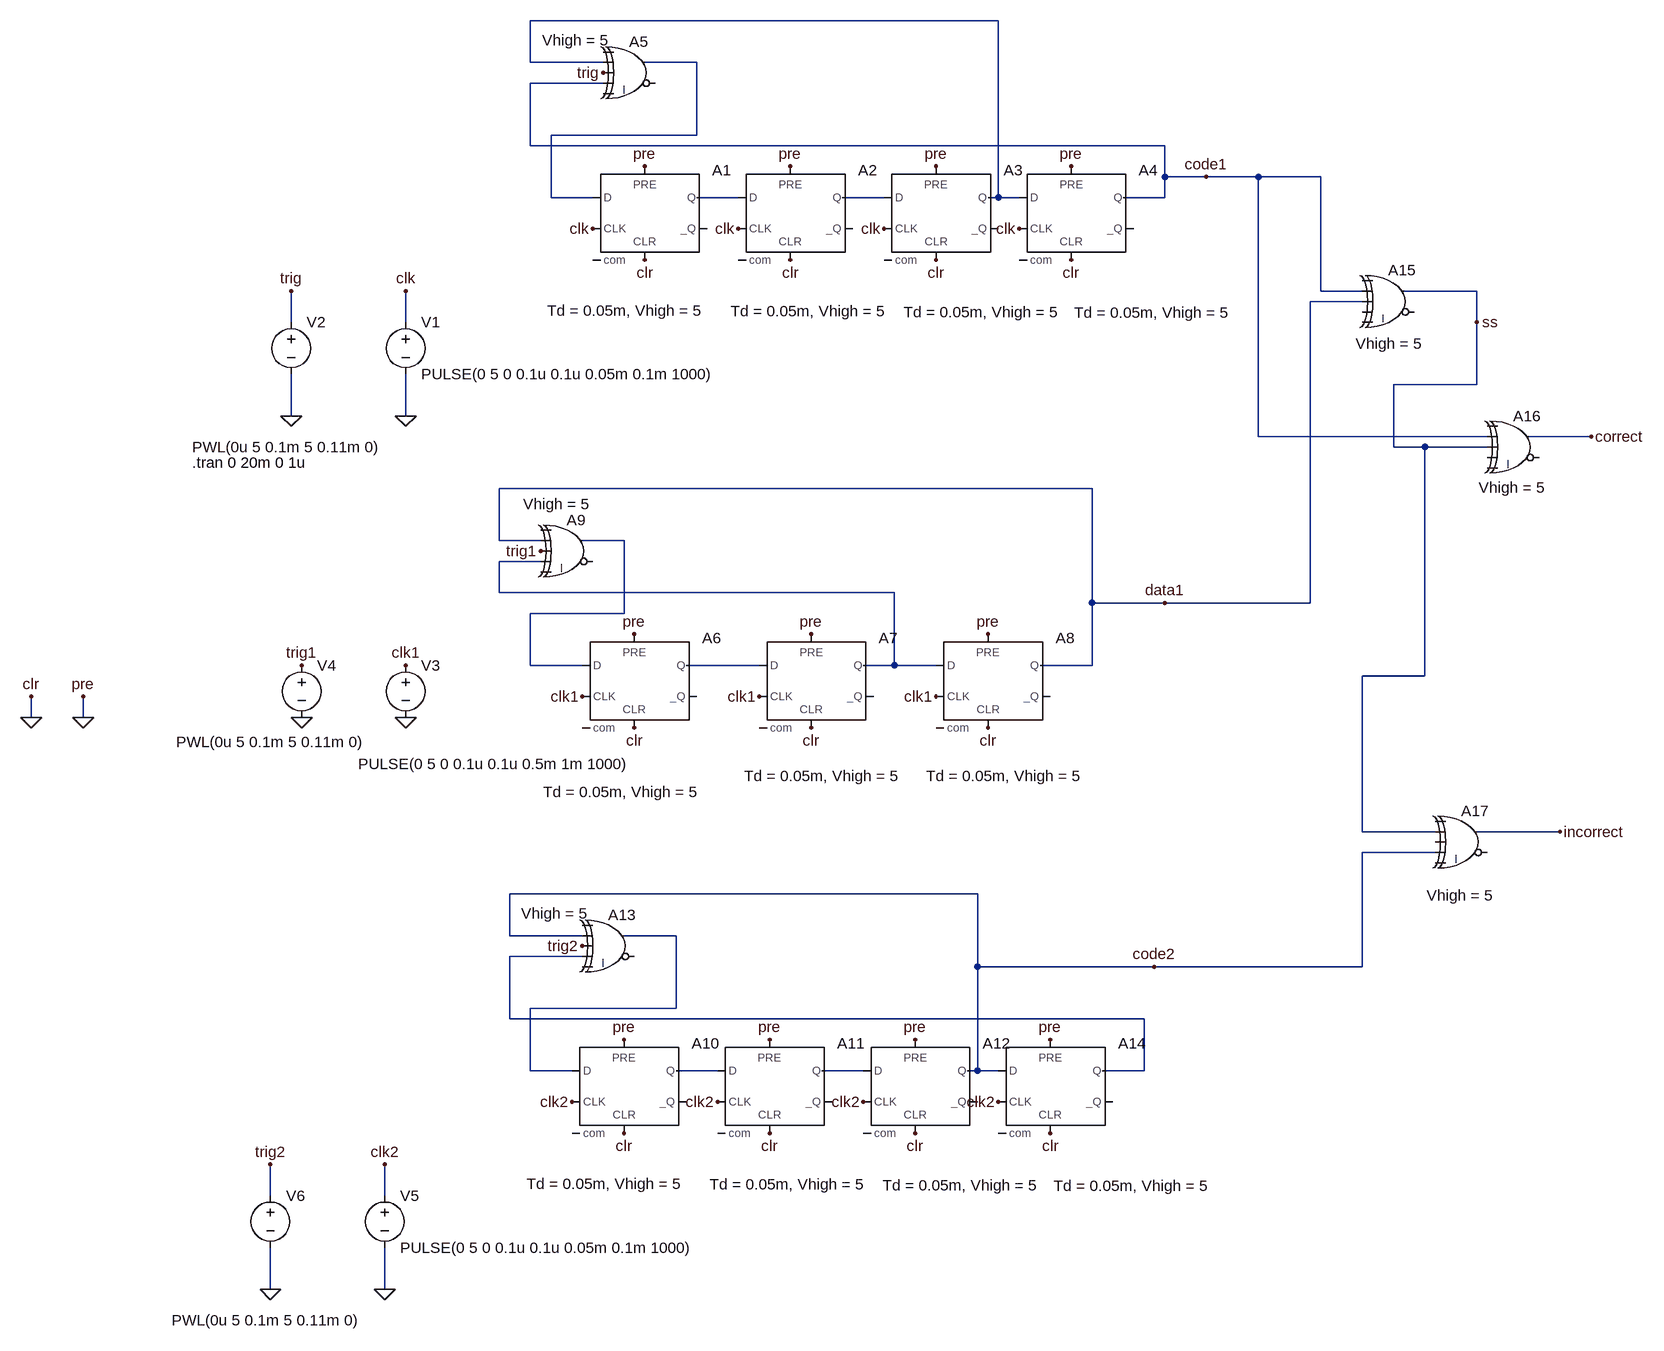
[diagram p0: schematic CDMA.asc]
CDMA.asc, the LTspice schematic file:
Version 4.1
SHEET 1 1652 1904
WIRE 640 -112 -80 -112
WIRE -80 -48 -80 -112
WIRE 32 -48 -80 -48
WIRE 176 -48 96 -48
WIRE 32 -16 -80 -16
WIRE 176 64 176 -48
WIRE 176 64 -48 64
WIRE -80 80 -80 -16
WIRE 896 80 -80 80
WIRE 896 128 896 80
WIRE 960 128 896 128
WIRE 1040 128 960 128
WIRE 1136 128 1040 128
WIRE -48 160 -48 64
WIRE 16 160 -48 160
WIRE 240 160 176 160
WIRE 464 160 400 160
WIRE 640 160 640 -112
WIRE 640 160 624 160
WIRE 672 160 640 160
WIRE 896 160 896 128
WIRE 896 160 832 160
WIRE 1136 304 1136 128
WIRE 1200 304 1136 304
WIRE 1376 304 1264 304
WIRE 1200 320 1120 320
WIRE -448 352 -448 304
WIRE -272 352 -272 304
WIRE 1376 352 1376 304
WIRE 1376 448 1376 352
WIRE 1376 448 1248 448
WIRE -448 496 -448 432
WIRE -272 496 -272 432
WIRE 1040 528 1040 128
WIRE 1392 528 1040 528
WIRE 1552 528 1456 528
WIRE 1248 544 1248 448
WIRE 1296 544 1248 544
WIRE 1392 544 1296 544
WIRE 784 608 -128 608
WIRE -128 688 -128 608
WIRE -64 688 -128 688
WIRE 64 688 0 688
WIRE -64 720 -128 720
WIRE -128 768 -128 720
WIRE 480 768 -128 768
WIRE 784 784 784 608
WIRE 896 784 784 784
WIRE 1120 784 1120 320
WIRE 1120 784 896 784
WIRE 64 800 64 688
WIRE 64 800 -80 800
WIRE -80 880 -80 800
WIRE 0 880 -80 880
WIRE 272 880 160 880
WIRE 480 880 480 768
WIRE 480 880 432 880
WIRE 544 880 480 880
WIRE 784 880 784 784
WIRE 784 880 704 880
WIRE 1296 896 1296 544
WIRE 1296 896 1200 896
WIRE -848 960 -848 928
WIRE -768 960 -768 928
WIRE 1200 1136 1200 896
WIRE 1312 1136 1200 1136
WIRE 1504 1136 1376 1136
WIRE 1312 1168 1200 1168
WIRE 608 1232 -112 1232
WIRE -112 1296 -112 1232
WIRE 0 1296 -112 1296
WIRE 144 1296 64 1296
WIRE 0 1328 -112 1328
WIRE 608 1344 608 1232
WIRE 880 1344 608 1344
WIRE 1200 1344 1200 1168
WIRE 1200 1344 880 1344
WIRE 144 1408 144 1296
WIRE 144 1408 -80 1408
WIRE -112 1424 -112 1328
WIRE 864 1424 -112 1424
WIRE -80 1504 -80 1408
WIRE -16 1504 -80 1504
WIRE 208 1504 144 1504
WIRE 432 1504 368 1504
WIRE 608 1504 608 1344
WIRE 608 1504 592 1504
WIRE 640 1504 608 1504
WIRE 864 1504 864 1424
WIRE 864 1504 800 1504
WIRE -480 1696 -480 1648
WIRE -304 1696 -304 1648
WIRE -480 1840 -480 1776
WIRE -304 1840 -304 1776
FLAG -272 304 clk
FLAG 16 208 clk
FLAG 240 208 clk
FLAG 464 208 clk
FLAG 672 208 clk
FLAG -272 496 0
FLAG -448 496 0
FLAG -448 304 trig
FLAG 32 -32 trig
FLAG -272 880 clk1
FLAG 0 928 clk1
FLAG 272 928 clk1
FLAG 544 928 clk1
FLAG -768 960 0
FLAG -768 928 pre
FLAG 96 112 pre
FLAG 320 112 pre
FLAG 544 112 pre
FLAG 752 112 pre
FLAG 80 832 pre
FLAG 352 832 pre
FLAG 624 832 pre
FLAG -848 960 0
FLAG -848 928 clr
FLAG 96 256 clr
FLAG 320 256 clr
FLAG 544 256 clr
FLAG 752 256 clr
FLAG 80 976 clr
FLAG 352 976 clr
FLAG 624 976 clr
FLAG -432 880 trig1
FLAG -64 704 trig1
FLAG -432 960 0
FLAG -272 960 0
FLAG -304 1648 clk2
FLAG -16 1552 clk2
FLAG 208 1552 clk2
FLAG 432 1552 clk2
FLAG 640 1552 clk2
FLAG -304 1840 0
FLAG -480 1840 0
FLAG -480 1648 trig2
FLAG 0 1312 trig2
FLAG 64 1456 pre
FLAG 288 1456 pre
FLAG 512 1456 pre
FLAG 720 1456 pre
FLAG 64 1600 clr
FLAG 288 1600 clr
FLAG 512 1600 clr
FLAG 720 1600 clr
FLAG 960 128 code1
FLAG 896 784 data1
FLAG 880 1344 code2
FLAG 1376 352 ss
FLAG 1552 528 correct
FLAG 1504 1136 incorrect
SYMBOL Digital\\dflop 96 112 R0
WINDOW 3 -150 222 Left 2
SYMATTR Value Td = 0.05m, Vhigh = 5
SYMATTR InstName A1
SYMBOL Digital\\dflop 320 112 R0
WINDOW 3 -92 223 Left 2
SYMATTR Value Td = 0.05m, Vhigh = 5
SYMATTR InstName A2
SYMBOL Digital\\dflop 544 112 R0
WINDOW 3 -50 224 Left 2
SYMATTR Value Td = 0.05m, Vhigh = 5
SYMATTR InstName A3
SYMBOL Digital\\xor 80 -96 R0
WINDOW 3 -142 14 Left 2
SYMATTR Value Vhigh = 5
SYMATTR InstName A5
SYMBOL Digital\\dflop 752 112 R0
WINDOW 3 5 225 Left 2
SYMATTR Value Td = 0.05m, Vhigh = 5
SYMATTR InstName A4
SYMBOL voltage -272 336 R0
WINDOW 123 0 0 Left 0
WINDOW 39 0 0 Left 0
SYMATTR InstName V1
SYMATTR Value PULSE(0 5 0 0.1u 0.1u 0.05m 0.1m 1000)
SYMBOL voltage -448 336 R0
WINDOW 3 -152 208 Left 2
WINDOW 123 0 0 Left 0
WINDOW 39 0 0 Left 0
SYMATTR Value PWL(0u 5 0.1m 5 0.11m 0)
SYMATTR InstName V2
SYMBOL Digital\\dflop 80 832 R0
WINDOW 3 -140 243 Left 2
SYMATTR Value Td = 0.05m, Vhigh = 5
SYMATTR InstName A6
SYMBOL Digital\\dflop 352 832 R0
WINDOW 3 -103 218 Left 2
SYMATTR Value Td = 0.05m, Vhigh = 5
SYMATTR InstName A7
SYMBOL Digital\\dflop 624 832 R0
WINDOW 3 -95 218 Left 2
SYMATTR Value Td = 0.05m, Vhigh = 5
SYMATTR InstName A8
SYMBOL Digital\\xor -16 640 R0
WINDOW 3 -75 -8 Left 2
SYMATTR Value Vhigh = 5
SYMATTR InstName A9
SYMBOL voltage -272 864 R0
WINDOW 3 -73 168 Left 2
WINDOW 123 0 0 Left 0
WINDOW 39 0 0 Left 0
SYMATTR Value PULSE(0 5 0 0.1u 0.1u 0.5m 1m 1000)
SYMATTR InstName V3
SYMBOL voltage -432 864 R0
WINDOW 3 -193 134 Left 2
WINDOW 123 0 0 Left 0
WINDOW 39 0 0 Left 0
SYMATTR Value PWL(0u 5 0.1m 5 0.11m 0)
SYMATTR InstName V4
SYMBOL Digital\\xor 1248 256 R0
WINDOW 3 -58 129 Left 2
SYMATTR Value Vhigh = 5
SYMATTR InstName A15
SYMBOL Digital\\xor 1440 480 R0
WINDOW 3 -61 126 Left 2
SYMATTR Value Vhigh = 5
SYMATTR InstName A16
SYMBOL Digital\\dflop 64 1456 R0
WINDOW 3 -150 222 Left 2
SYMATTR Value Td = 0.05m, Vhigh = 5
SYMATTR InstName A10
SYMBOL Digital\\dflop 288 1456 R0
WINDOW 3 -92 223 Left 2
SYMATTR Value Td = 0.05m, Vhigh = 5
SYMATTR InstName A11
SYMBOL Digital\\dflop 512 1456 R0
WINDOW 3 -50 224 Left 2
SYMATTR Value Td = 0.05m, Vhigh = 5
SYMATTR InstName A12
SYMBOL Digital\\xor 48 1248 R0
WINDOW 3 -142 14 Left 2
SYMATTR Value Vhigh = 5
SYMATTR InstName A13
SYMBOL Digital\\dflop 720 1456 R0
WINDOW 3 5 225 Left 2
SYMATTR Value Td = 0.05m, Vhigh = 5
SYMATTR InstName A14
SYMBOL voltage -304 1680 R0
WINDOW 123 0 0 Left 0
WINDOW 39 0 0 Left 0
SYMATTR InstName V5
SYMATTR Value PULSE(0 5 0 0.1u 0.1u 0.05m 0.1m 1000)
SYMBOL voltage -480 1680 R0
WINDOW 3 -152 208 Left 2
WINDOW 123 0 0 Left 0
WINDOW 39 0 0 Left 0
SYMATTR Value PWL(0u 5 0.1m 5 0.11m 0)
SYMATTR InstName V6
SYMBOL Digital\\xor 1360 1088 R0
WINDOW 3 -61 146 Left 2
SYMATTR Value Vhigh = 5
SYMATTR InstName A17
TEXT -600 568 Left 2 !.tran 0 20m 0 1u

The netlist it stands for:
* CDMA.asc
A1 N002 0 clk 0 0 0 N003 0 DFLOP Td = 0.05m, Vhigh = 5
A2 N003 0 clk 0 0 0 N004 0 DFLOP Td = 0.05m, Vhigh = 5
A3 N004 0 clk 0 0 0 N001 0 DFLOP Td = 0.05m, Vhigh = 5
A5 0 N001 trig code1 0 0 N002 0 XOR Vhigh = 5
A4 N001 0 clk 0 0 0 code1 0 DFLOP Td = 0.05m, Vhigh = 5
V1 clk 0 PULSE(0 5 0 0.1u 0.1u 0.05m 0.1m 1000)
V2 trig 0 PWL(0u 5 0.1m 5 0.11m 0)
A6 N005 0 clk1 0 0 0 N007 0 DFLOP Td = 0.05m, Vhigh = 5
A7 N007 0 clk1 0 0 0 N006 0 DFLOP Td = 0.05m, Vhigh = 5
A8 N006 0 clk1 0 0 0 data1 0 DFLOP Td = 0.05m, Vhigh = 5
A9 0 data1 trig1 N006 0 0 N005 0 XOR Vhigh = 5
V3 clk1 0 PULSE(0 5 0 0.1u 0.1u 0.5m 1m 1000)
V4 trig1 0 PWL(0u 5 0.1m 5 0.11m 0)
A15 0 code1 data1 0 0 0 ss 0 XOR Vhigh = 5
A16 0 code1 ss 0 0 0 correct 0 XOR Vhigh = 5
A10 N008 0 clk2 0 0 0 N010 0 DFLOP Td = 0.05m, Vhigh = 5
A11 N010 0 clk2 0 0 0 N011 0 DFLOP Td = 0.05m, Vhigh = 5
A12 N011 0 clk2 0 0 0 code2 0 DFLOP Td = 0.05m, Vhigh = 5
A13 0 code2 trig2 N009 0 0 N008 0 XOR Vhigh = 5
A14 code2 0 clk2 0 0 0 N009 0 DFLOP Td = 0.05m, Vhigh = 5
V5 clk2 0 PULSE(0 5 0 0.1u 0.1u 0.05m 0.1m 1000)
V6 trig2 0 PWL(0u 5 0.1m 5 0.11m 0)
A17 0 ss 0 code2 0 0 incorrect 0 XOR Vhigh = 5
.tran 0 20m 0 1u
.backanno
.end